# EAGLE design MainBoardV2 (EAGLE 7.2.0)
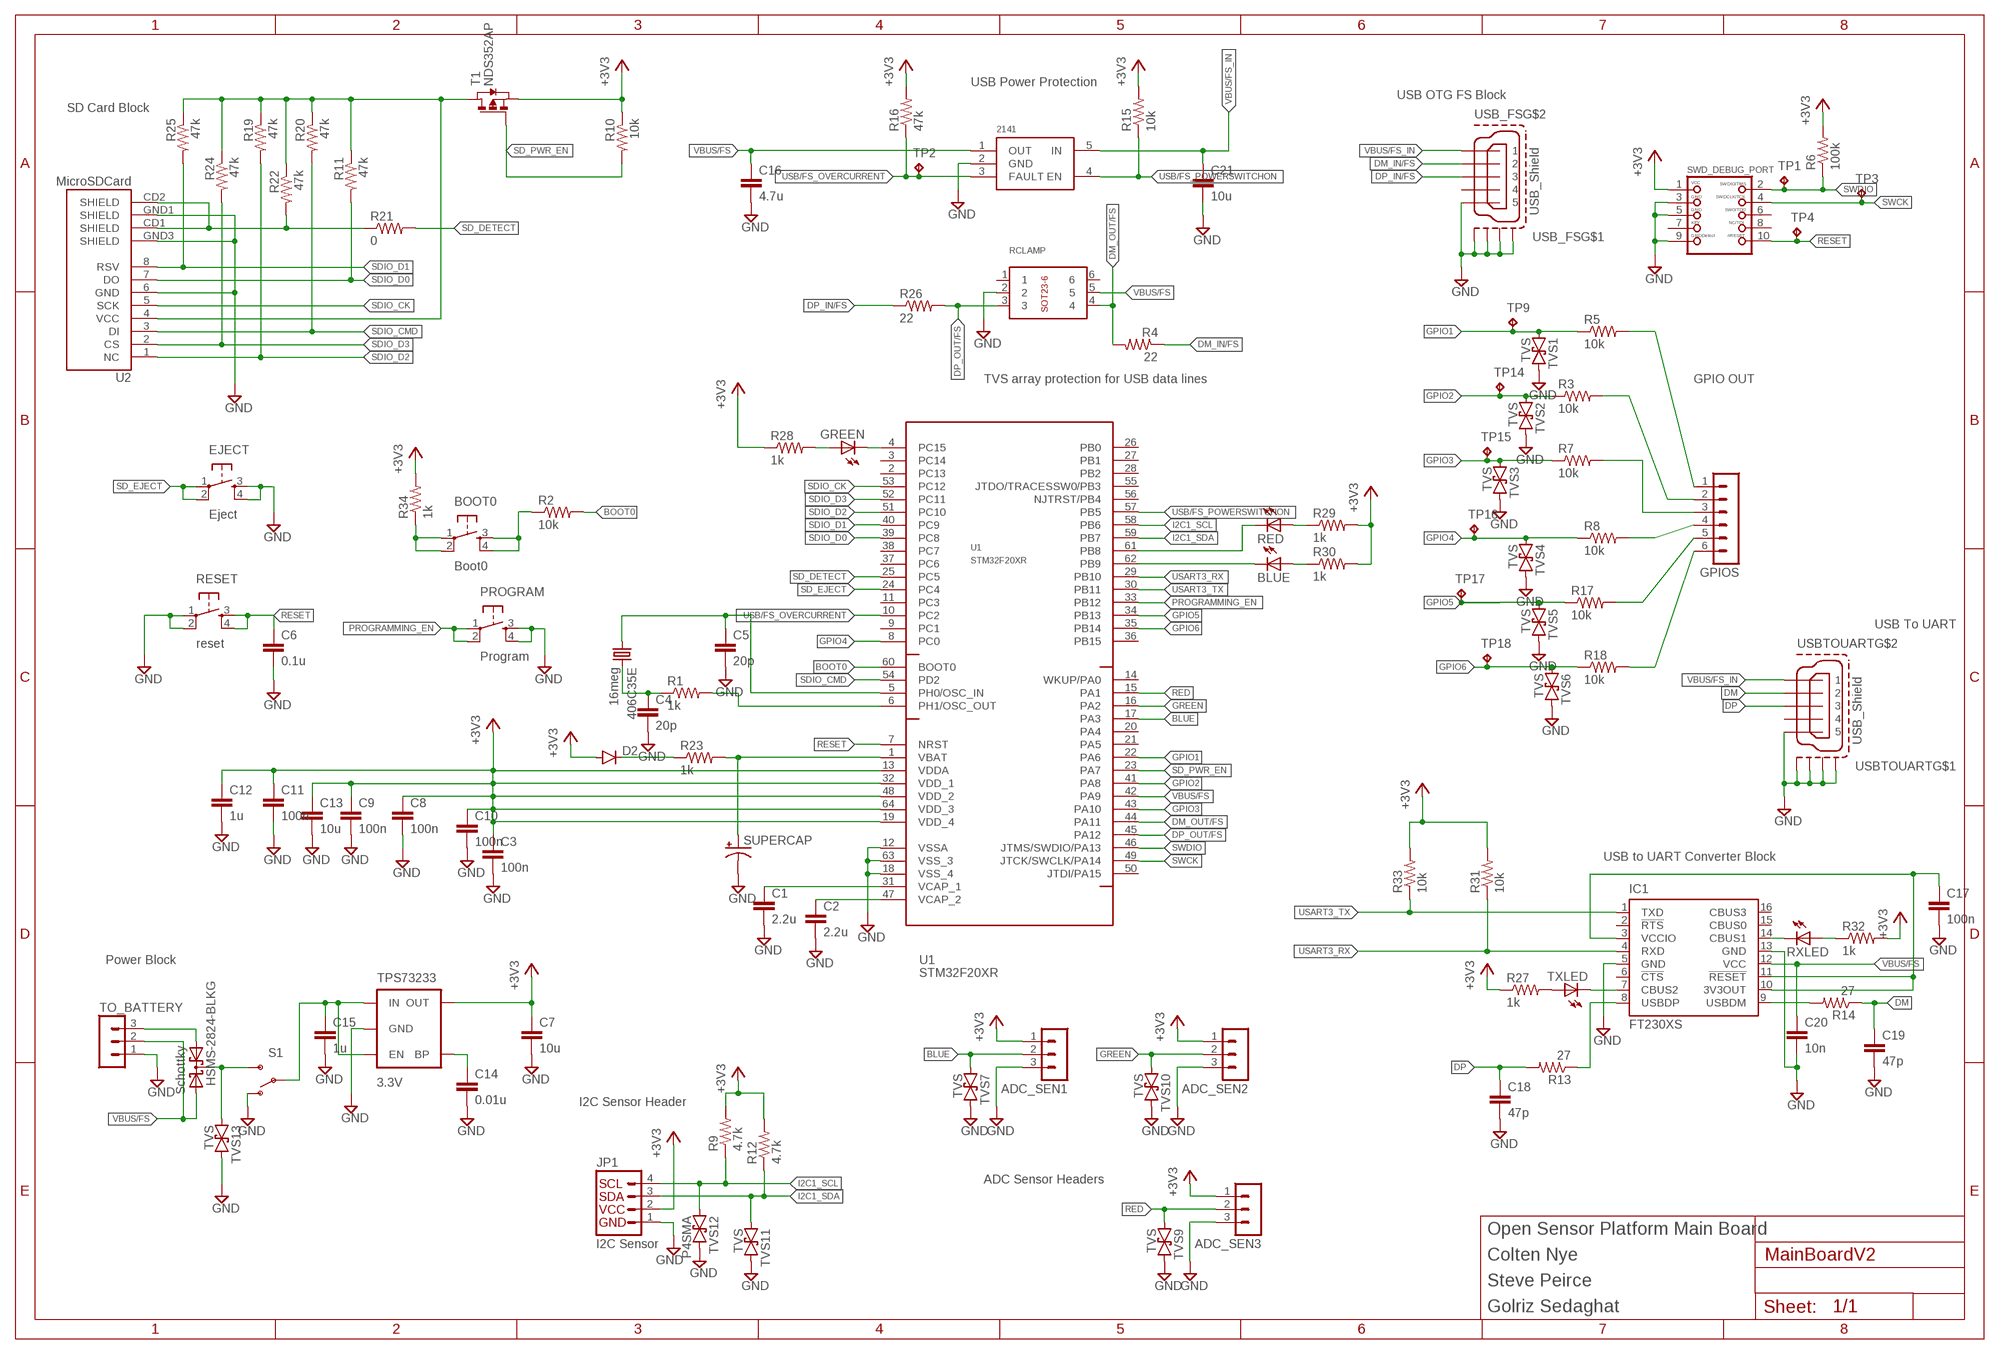
[diagram p0: schematic, sheet 1]

## Parts
406C35E  16meg  CRYSTALCTS406  [CTS406]
2141  NCP1400A_STEPUP  [SOT23-5]
ADC_SEN1  MA03-1  [MA03-1]
ADC_SEN2  MA03-1  [MA03-1]
ADC_SEN3  MA03-1  [MA03-1]
BLUE  LEDSML0805  [SML0805]
BOOT0  Boot0  TAC_SWITCHSMD  [TACTILE-SWITCH-SMD]
C1  2.2u  C-EUC0805  [C0805]
C2  2.2u  C-EUC0805  [C0805]
C3  100n  C-EUC0805  [C0805]
C4  20p  C-EUC0805  [C0805]
C5  20p  C-EUC0805  [C0805]
C6  0.1u  C-EUC0805  [C0805]
C7  10u  C-EUC0805  [C0805]
C8  100n  C-EUC0805  [C0805]
C9  100n  C-EUC0805  [C0805]
C10  100n  C-EUC0805  [C0805]
C11  100n  C-EUC0805  [C0805]
C12  1u  C-EUC0805  [C0805]
C13  10u  C-EUC0805  [C0805]
C14  0.01u  C-EUC0805  [C0805]
C15  1u  C-EUC0805  [C0805]
C16  4.7u  C-EUC0805  [C0805]
C17  100n  C-EUC0805  [C0805]
C18  47p  C-EUC0805  [C0805]
C19  47p  C-EUC0805  [C0805]
C20  10n  C-EUC0805  [C0805]
C21  10u  C-EUC0805  [C0805]
D2  DIODESMA  [SMA-DIODE]
EJECT  Eject  TAC_SWITCHSMD  [TACTILE-SWITCH-SMD]
GPIOS  MA06-1  [MA06-1]
GREEN  LEDSML0805  [SML0805]
HSMS-2824-BLKG  Schottky  BAS70-05  [SOT23]
IC1  FT230XS  [SSOP16]
JP1  I2C Sensor  I2C_STANDARD  [1X04]
PROGRAM  Program  TAC_SWITCHSMD  [TACTILE-SWITCH-SMD]
R1  1k  R-US_R0805  [R0805]
R2  10k  R-US_R0805  [R0805]
R3  10k  R-US_R0805  [R0805]
R4  22  R-US_R0805  [R0805]
R5  10k  R-US_R0805  [R0805]
R6  100k  R-US_R0805  [R0805]
R7  10k  R-US_R0805  [R0805]
R8  10k  R-US_R0805  [R0805]
R9  4.7k  R-US_R0805  [R0805]
R10  10k  R-US_R0805  [R0805]
R11  47k  R-US_R0805  [R0805]
R12  4.7k  R-US_R0805  [R0805]
R13  27  R-US_R0805  [R0805]
R14  27  R-US_R0805  [R0805]
R15  10k  R-US_R0805  [R0805]
R16  47k  R-US_R0805  [R0805]
R17  10k  R-US_R0805  [R0805]
R18  10k  R-US_R0805  [R0805]
R19  47k  R-US_R0805  [R0805]
R20  47k  R-US_R0805  [R0805]
R21  0  R-US_R0805  [R0805]
R22  47k  R-US_R0805  [R0805]
R23  1k  R-US_R0805  [R0805]
R24  47k  R-US_R0805  [R0805]
R25  47k  R-US_R0805  [R0805]
R26  22  R-US_R0805  [R0805]
R27  1k  R-US_R0805  [R0805]
R28  1k  R-US_R0805  [R0805]
R29  1k  R-US_R0805  [R0805]
R30  1k  R-US_R0805  [R0805]
R31  10k  R-US_R0805  [R0805]
R32  1k  R-US_R0805  [R0805]
R33  10k  R-US_R0805  [R0805]
R34  1k  R-US_R0805  [R0805]
RCLAMP  BREAKOUT_SOT23-6  [BREAKOUT_SOT23-6]
RED  LEDSML0805  [SML0805]
RESET  reset  TAC_SWITCHSMD  [TACTILE-SWITCH-SMD]
RXLED  LEDSML0805  [SML0805]
S1  SWITCH-SPDTSMD  [AYZ0202]
SUPERCAP  SUPERCAP  [414-VA5R]
SWD_DEBUG_PORT  JTAG-CORTEXM3  [2X05_1.27MM_SMT]
T1  NDS352AP  PMOSSOT23  [SOT-23]
TO_BATTERY  MA03-1  [MA03-1]
TP1  TPB1,27  [B1,27]
TP2  TPB1,27  [B1,27]
TP3  TPB1,27  [B1,27]
TP4  TPB1,27  [B1,27]
TP9  TPB1,27  [B1,27]
TP14  TPB1,27  [B1,27]
TP15  TPB1,27  [B1,27]
TP16  TPB1,27  [B1,27]
TP17  TPB1,27  [B1,27]
TP18  TPB1,27  [B1,27]
TPS73233  3.3V  V_REG_MIC52053.3V  [SOT23-5]
TVS1  TVS  [SMA-DIODE]
TVS2  TVS  [SMA-DIODE]
TVS3  TVS  [SMA-DIODE]
TVS4  TVS  [SMA-DIODE]
TVS5  TVS  [SMA-DIODE]
TVS6  TVS  [SMA-DIODE]
TVS7  TVS  [SMA-DIODE]
TVS9  TVS  [SMA-DIODE]
TVS10  TVS  [SMA-DIODE]
TVS11  TVS  [SMA-DIODE]
TVS12  P4SMA  TVS  [SMA-DIODE]
TVS13  TVS  [SMA-DIODE]
TXLED  LEDSML0805  [SML0805]
U1  STM32F20XR  [LQFP64]
U2  MicroSDCard  USD-SOCKETNEW  [MICRO-SD-SOCKET-PP]
USB_FS  USB_Shield  MICRO-USB-SHIELD-ZX62R-B-5P  [ZX62R-B-5P]
USBTOUART  USB_Shield  MICRO-USB-SHIELD-ZX62R-B-5P  [ZX62R-B-5P]

## Nets
+3V3: ADC_SEN1.1 ADC_SEN2.1 ADC_SEN3.1 C3.1 C7.1 C8.1 C9.1 C10.1 C11.1 C12.1 C13.1 D2.A JP1.2 R6.2 R9.2 R10.1 R12.2 R15.2 R16.2 R27.1 R28.1 R29.2 R30.2 R31.2 R32.2 R33.2 R34.2 SWD_DEBUG_PORT.1 T1.2(S) TPS73233.5(OUT) U1.13(VDDA) U1.19(VDD_4) U1.32(VDD_1) U1.48(VDD_2) U1.64(VDD_3)
BLUE: ADC_SEN1.2 TVS7.A U1.17(PA3)
BOOT0: R2.2 U1.60(BOOT0)
DEBUG_LED/NP1: GPIOS.1 R5.2
DEBUG_LED/NP2: GPIOS.2 R3.2
DEBUG_LED/NP3: GPIOS.3 R7.2
DEBUG_LED/NP4: GPIOS.4 R8.2
DEBUG_LED/NP5: GPIOS.5 R17.2
DEBUG_LED/NP6: GPIOS.6 R18.2
DM: C19.1 R14.1 USBTOUART.2
DM_IN/FS: R4.1 USB_FS.2
DM_OUT/FS: R4.2 RCLAMP.4 U1.44(PA11)
DP: C18.1 R13.2 USBTOUART.3
DP_IN/FS: R26.1 USB_FS.3
DP_OUT/FS: R26.2 RCLAMP.3 U1.45(PA12)
GND: 2141.2(GND) ADC_SEN1.3 ADC_SEN2.3 ADC_SEN3.3 C1.2 C2.2 C3.2 C4.2 C5.2 C6.2 C7.2 C8.2 C9.2 C10.2 C11.2 C12.2 C13.2 C14.2 C15.2 C16.2 C17.2 C18.2 C19.2 C20.2 C21.2 EJECT.3 EJECT.4 IC1.5(GND) IC1.13(GND) JP1.1 PROGRAM.3 PROGRAM.4 RCLAMP.2 RESET.1 RESET.2 S1.1(O) SUPERCAP.- SWD_DEBUG_PORT.3 SWD_DEBUG_PORT.5 SWD_DEBUG_PORT.9 TO_BATTERY.1 TPS73233.2(GND) TVS1.C TVS2.C TVS3.C TVS4.C TVS5.C TVS6.C TVS7.C TVS9.C TVS10.C TVS11.C TVS12.C TVS13.C U1.12(VSSA) U1.18(VSS_4) U1.63(VSS_3) U2.6(GND) U2.GND1(SHIELD) U2.GND3(SHIELD) USB_FS.5 USB_FS.M1(S1) USB_FS.M2(S2) USB_FS.M3(S3) USB_FS.M4(S4) USBTOUART.5 USBTOUART.M1(S1) USBTOUART.M2(S2) USBTOUART.M3(S3) USBTOUART.M4(S4)
GPIO1: R5.1 TP9.TP TVS1.A U1.22(PA6)
GPIO2: R3.1 TP14.TP TVS2.A U1.41(PA8)
GPIO3: R7.1 TP15.TP TVS3.A U1.43(PA10)
GPIO4: R8.1 TP16.TP TVS4.A U1.8(PC0)
GPIO5: R17.1 TP17.TP TVS5.A U1.34(PB13)
GPIO6: R18.1 TP18.TP TVS6.A U1.35(PB14)
GREEN: ADC_SEN2.2 TVS10.A U1.16(PA2)
I2C1_SCL: JP1.4 R9.1 TVS12.A U1.58(PB6)
I2C1_SDA: JP1.3 R12.1 TVS11.A U1.59(PB7)
N$1: C1.1 U1.31(VCAP_1)
N$2: C2.1 U1.47(VCAP_2)
N$3: GREEN.C U1.4(PC15)
N$4: HSMS-2824-BLKG.1(A1) TO_BATTERY.3
N$5: 406C35E.3 C4.1 R1.1
N$6: BOOT0.3 BOOT0.4 R2.1
N$7: C17.1 IC1.3(VCCIO) IC1.10(3V3OUT) IC1.11(!RESET)
N$8: IC1.9(USBDM) R14.2
N$9: IC1.8(USBDP) R13.1
N$10: C14.1 TPS73233.4(BP)
N$11: BOOT0.1 BOOT0.2 R34.1
N$12: R27.2 TXLED.A
N$13: BLUE.C U1.62(PB9)
N$14: R21.1 R22.2 U2.CD1(SHIELD) U2.CD2(SHIELD)
N$15: D2.C R23.1
N$16: R29.1 RED.A
N$17: GREEN.A R28.2
N$18: BLUE.A R30.1
N$19: R32.1 RXLED.A
N$20: RED.C U1.61(PB8)
N$21: HSMS-2824-BLKG.3(C) S1.3(S) TVS13.A
N$22: IC1.14(CBUS1) RXLED.C
N$23: IC1.7(CBUS2) TXLED.C
N$26: R11.1 R19.1 R20.1 R22.1 R24.1 R25.1 T1.1(D) U2.4(VCC)
OSC_IN: 406C35E.1 C5.1 U1.5(PH0/OSC_IN)
OSC_OUT: R1.2 U1.6(PH1/OSC_OUT)
PROGRAMMING_EN: PROGRAM.1 PROGRAM.2 U1.33(PB12)
RED: ADC_SEN3.2 TVS9.A U1.15(PA1)
RESET: C6.1 RESET.3 RESET.4 SWD_DEBUG_PORT.10 TP4.TP U1.7(NRST)
SD_DETECT: R21.2 U1.25(PC5)
SD_EJECT: EJECT.1 EJECT.2 U1.24(PC4)
SD_PWR_EN: R10.2 T1.3(G) U1.23(PA7)
SDIO_CK: U1.53(PC12) U2.5(SCK)
SDIO_CMD: R20.2 U1.54(PD2) U2.3(DI)
SDIO_D0: R11.2 U1.39(PC8) U2.7(DO)
SDIO_D1: R25.2 U1.40(PC9) U2.8(RSV)
SDIO_D2: R19.2 U1.51(PC10) U2.1(NC)
SDIO_D3: R24.2 U1.52(PC11) U2.2(CS)
SWCK: SWD_DEBUG_PORT.4 TP3.TP U1.49(JTCK/SWCLK/PA14)
SWDIO: R6.1 SWD_DEBUG_PORT.2 TP1.TP U1.46(JTMS/SWDIO/PA13)
USART3_RX: IC1.4(RXD) R31.1 U1.29(PB10)
USART3_TX: IC1.1(TXD) R33.1 U1.30(PB11)
USB/FS_OVERCURRENT: 2141.3(FAULT) R16.1 TP2.TP U1.10(PC2)
USB/FS_POWERSWITCHON: 2141.4(EN) R15.1 U1.57(PB5)
VBAT: R23.2 SUPERCAP.+ U1.1(VBAT)
VBUS/FS: 2141.1(OUT) C16.1 C20.1 HSMS-2824-BLKG.2(A2) IC1.12(VCC) RCLAMP.5 TO_BATTERY.2 U1.42(PA9)
VBUS/FS_IN: 2141.5(IN) C21.1 USB_FS.1 USBTOUART.1
VIN: C15.1 S1.2(P) TPS73233.1(IN) TPS73233.3(EN)
Unconnected: IC1.2(!RTS) IC1.6(!CTS) IC1.15(CBUS0) IC1.16(CBUS3) RCLAMP.1 RCLAMP.6 SWD_DEBUG_PORT.6 SWD_DEBUG_PORT.7 SWD_DEBUG_PORT.8 U1.2(PC13) U1.3(PC14) U1.9(PC1) U1.11(PC3) U1.14(WKUP/PA0) U1.20(PA4) U1.21(PA5) U1.26(PB0) U1.27(PB1) U1.28(PB2) U1.36(PB15) U1.37(PC6) U1.38(PC7) U1.50(JTDI/PA15) U1.55(JTDO/TRACESSW0/PB3) U1.56(NJTRST/PB4) USB_FS.4 USBTOUART.4

## Notes on the sheet
- USB Power Protection
- USB OTG FS Block
- SD Card Block
- TVS array protection for USB data lines | GPIO OUT
- USB To UART
- USB to UART Converter Block
- Power Block
- I2C Sensor Header
- ADC Sensor Headers
- Open Sensor Platform Main Board
- Colten Nye
- Steve Peirce
- Golriz Sedaghat

## Library data of the parts
406C35E = crystal:CRYSTAL: CRYSTAL; OC_FARNELL: unknown; OC_NEWARK: unknown
2141 = microbuilder:NCP1400A_STEPUP: NCP1400A - 100mA PWM Step-Up Regulator 100mA step-up DC-to-DC converter with low 0.8V startup. 3.3V Version (SOT23-5) - Digikey: NCP1400ASN33T1GOSCT-ND 5.0V Version (SOT23-5) - Digikey: NCP1400ASN50T1GOSCT-ND NCP1402 - 200mA PWM Step-Up Regulator 200mA step-up DC-to-DC converter with low 0.8V startup 3.3V Version (SOT23-5) - Digikey: NCP1402SN33T1GOSCT-ND 5.0V Version (SOT23-5) - Digikey: NCP1402SN50T1GOSCT-ND
ADC_SEN1-ADC_SEN3 TO_BATTERY = con-lstb:MA03-1: PIN HEADER; OC_FARNELL: unknown; OC_NEWARK: unknown
BLUE GREEN RED RXLED TXLED = led:LED: LED OSRAM: - CHIPLED LG R971, LG N971, LY N971, LG Q971, LY Q971, LO R971, LY R971 LH N974, LH R974 LS Q976, LO Q976, LY Q976 LO Q996 - Hyper CHIPLED LW Q18S LB Q993, LB Q99A, LB R99A - SideLED LS A670, LO A670, LY A670, LG A670, LP A670 LB A673, LV A673, LT A673, LW A673 LH A674 LY A675 LS A676, LA A676, LO A676, LY A676, LW A676 LS A679, LY A679, LG A679 - Hyper Micro SIDELED® LS Y876, LA Y876, LO Y876, LY Y876 LT Y87S - SmartLED LW L88C, LW L88S LB L89C, LB L89S, LG L890 LS L89K, LO L89K, LY L89K LS L896, LA L896, LO L896, LY L896 - TOPLED LS T670, LO T670, LY T670, LG T670, LP T670 LSG T670, LSP T670, LSY T670, LOP T670, LYG T670 LG T671, LOG T671, LSG T671 LB T673, LV T673, LT T673, LW T673 LH T674 LS T676, LA T676, LO T676, LY T676, LB T676, LH T676, LSB T676, LW T676 LB T67C, LV T67C, LT T67C, LS T67K, LO T67K, LY T67K, LW E67C LS E67B, LA E67B, LO E67B, LY E67B, LB E67C, LV E67C, LT E67C LW T67C LS T679, LY T679, LG T679 LS T770, LO T770, LY T770, LG T770, LP T770 LB T773, LV T773, LT T773, LW T773 LH T774 LS E675, LA E675, LY E675, LS T675 LS T776, LA T776, LO T776, LY T776, LB T776 LHGB T686 LT T68C, LB T68C - Hyper Mini TOPLED® LB M676 - Mini TOPLED Santana® LG M470 LS M47K, LO M47K, LY M47K Source: http://www.osram.convergy.de LUXEON: - LUMILED® LXK2-PW12-R00, LXK2-PW12-S00, LXK2-PW14-U00, LXK2-PW14-V00 LXK2-PM12-R00, LXK2-PM12-S00, LXK2-PM14-U00 LXK2-PE12-Q00, LXK2-PE12-R00, LXK2-PE12-S00, LXK2-PE14-T00, LXK2-PE14-U00 LXK2-PB12-K00, LXK2-PB12-L00, LXK2-PB12-M00, LXK2-PB14-N00, LXK2-PB14-P00, LXK2-PB14-Q00 LXK2-PR12-L00, LXK2-PR12-M00, LXK2-PR14-Q00, LXK2-PR14-R00 LXK2-PD12-Q00, LXK2-PD12-R00, LXK2-PD12-S00 LXK2-PH12-R00, LXK2-PH12-S00 LXK2-PL12-P00, LXK2-PL12-Q00, LXK2-PL12-R00 Source: www.luxeon.com KINGBRIGHT: KA-3528ASYC Source: www.kingbright.com
BOOT0 EJECT PROGRAM RESET = SparkFun-Electromechanical:TAC_SWITCH: Momentary Switch Button commonly used for reset or general input. Spark Fun Electronics SKU : COM-00097 SMT- SWCH-08247; PROD_ID: SWCH-08247; VALUE: TAC_SWITCHSMD
C1-C21 = rcl:C-EU: CAPACITOR, European symbol
D2 = SparkFun-DiscreteSemi:DIODE: Diode These are standard reverse protection diodes and small signal diodes. SMA package can handle up to about 1A. SOD-323 can handle about 200mA. What the SOD-323 package when ordering, there are some mfgs out there that are 5-pin packages.
GPIOS = con-lstb:MA06-1: PIN HEADER; OC_FARNELL: unknown; OC_NEWARK: unknown
HSMS-2824-BLKG = diode:BAS70-05: Silicon Schottky Diodes General-purpose diode for high-speed switching
IC1 = ftdichip:FT230X: USB to BASIC UART IC Auto generated by make-symbol-device-package-bsdl.ulp Rev. 43 Source: Data sheet <http://www.ftdichip.com/Support/Documents/DataSheets/ICs/DS_FT230X.pdf>
JP1 = SparkFun-Connectors:I2C_STANDARD: SparkFun has standardized on a pinout for all I2C based sensor breakouts. This pinout allows I2C boards to be plugged directly into the headers on Arduino Uno compatible boards, and to be daisy chained easily.
R1-R34 = rcl:R-US_: RESISTOR, American symbol
RCLAMP = microbuilder:BREAKOUT_SOT23-6: IC Breakout SOT23-6
S1 = SparkFun-Electromechanical:SWITCH-SPDT: SPDT Switch Simple slide switch, Spark Fun Electronics SKU : COM-00102 DPDT SMT slide switch, AYZ0202, SWCH-08179; PROD_ID: SWCH-08179
SUPERCAP = adafruit:SUPERCAP
SWD_DEBUG_PORT = microbuilder:JTAG-CORTEXM3: Serial Wire (SW-DP) Connector This standard 0.05" 10-pin connector is for use with the Cortex M0/M3's native SWD (serial wire debugger) interface (SW-DP). Some boards support a 20-pin combined JTAG+SWD connector (SWJ-DP), such as the LPC1700 family, but many smaller devices only work with SWD which typically use the smaller 10-pin SW-DP connecter (the LPC1300 family, for example, only supports SWD). 2x05 1.27mm/0.05" Connector: This is the standard SMT connector defined by ARM for all Cortex devices, and should be used in most situations and for forward-compatibility since any new devices coming to market will likely use this connector. MOLEX 10 Pin 0.1" Connector: This 0.1" 10 pin connector has the same pin layout as the standard 0.05" connector, but is easier to work with if you are using standard jumper wires or custom cables to connect your SWD hardware. MOLEX 20 Pin 0.1" Connector: This 0.1" 20 pin connector is the same model used for ARM7/ARM9 JTAG debuggers, but is connected to match the pins on the Segger J-Link for ARM (which supports both JTAG and SWD debugging). See the following document from ARM for more information on Cortex M3 Debug Connectors: http://infocenter.arm.com/help/topic/com.arm.doc.faqs/attached/13634/cortex_debug_connectors.pdf And the following page for an overview with images of the different connector types: http://www.keil.com/peripherals/coresight/connectors.asp
T1 = zetex:PMOSSOT23: MOS FET; OC_FARNELL: unknown; OC_NEWARK: unknown
TP1-TP4 TP9 TP14-TP18 = testpad:TP: Test pad
TPS73233 = SparkFun-PowerIC:V_REG_MIC5205: V_REG MIC5219 Standard 3.3V and 5V 150mA LDO voltage regulator in SOT-23 layout. Micrel part MIC5205. BP (by-pass) pin is used to lower output noise with 470pF cap, may be left open.; PROD_ID: VREG-00822; VALUE: 3.3V/150mA
TVS1-TVS7 TVS9-TVS13 = SparkFun-DiscreteSemi:TVS: Transient voltage suppressor- prevents ESD on inputs. Ignore package description- MBRA140 is NOT this type of part!!!
U1 = stm32F:STM32F20XR
U2 = SparkFun-Connectors:USD-SOCKET: microSD Socket Push-push type uSD socket. Schematic element and footprint production proven. Spark Fun Electronics SKU : PRT-00127. tDoc lines correctly indicate media card edge positions when inserting (unlocked, locked, depressed).
USB_FS USBTOUART = con-hirose:MICRO-USB-SHIELD-: Hirose Micro USB Connector ZX62R-B-5P: Micro B, reverse (top mount) shell SMT Supplier: DigiKey H11574CT-ND Source: http://www.hirose.co.jp/cataloge_hp/e24200011.pdf

## Board
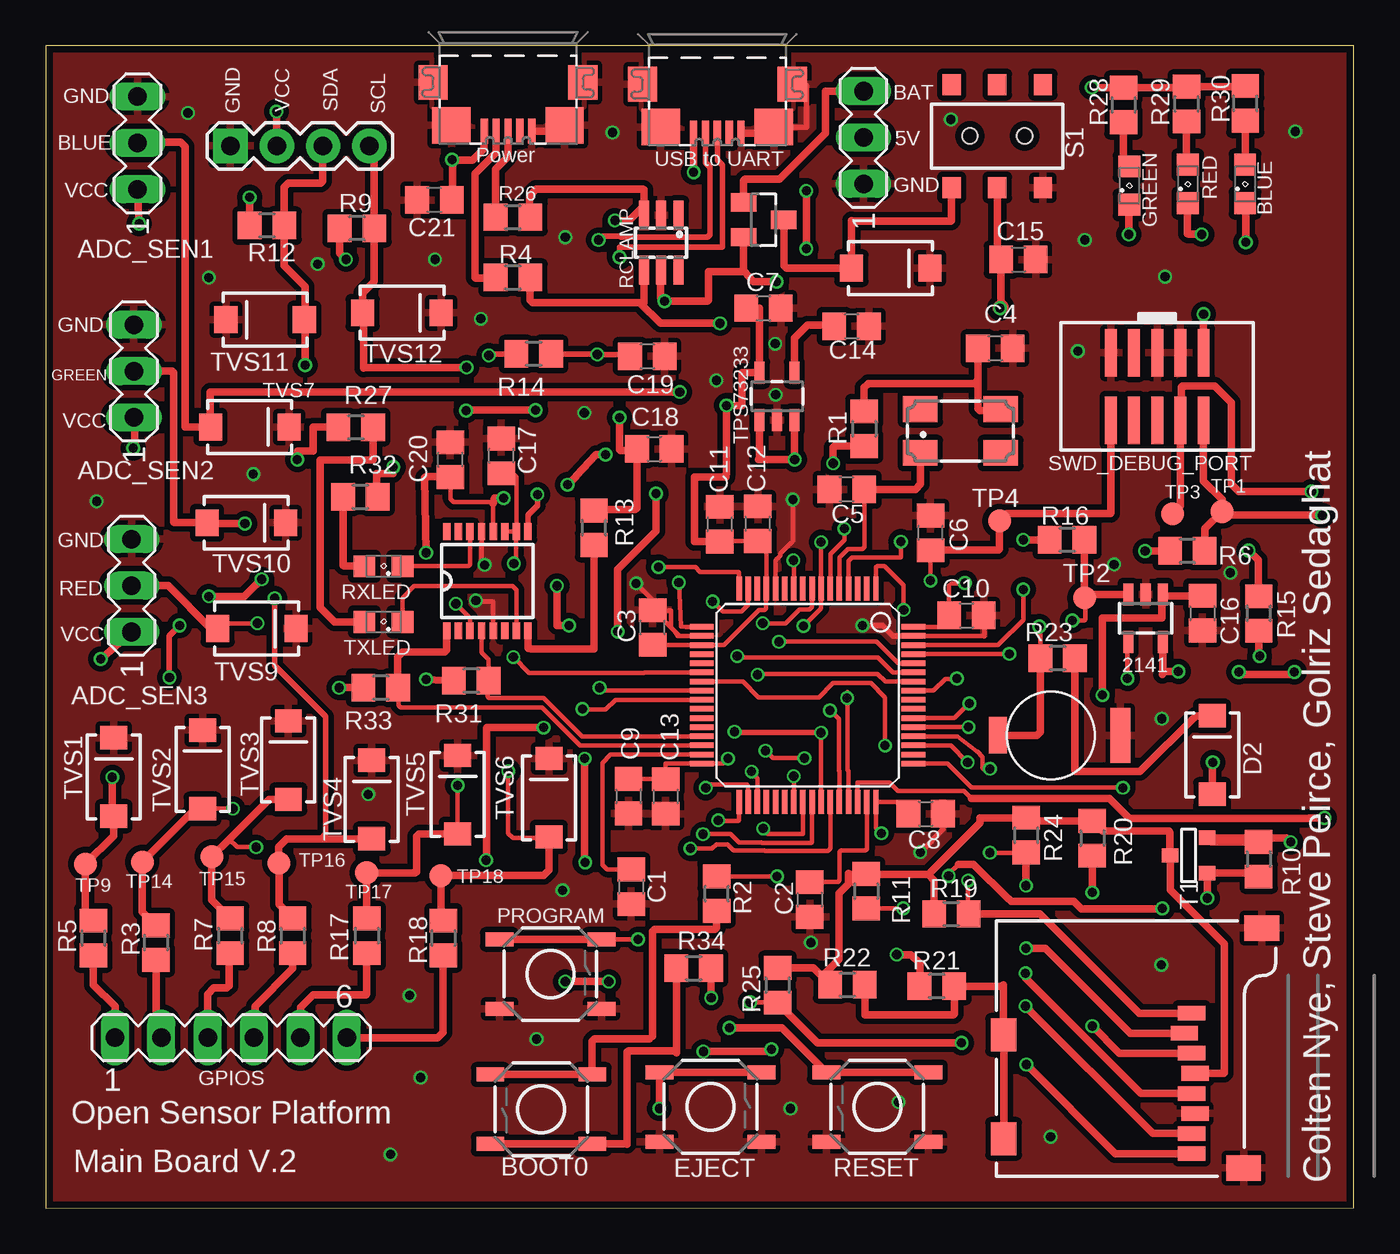
[diagram p1: board, top side]
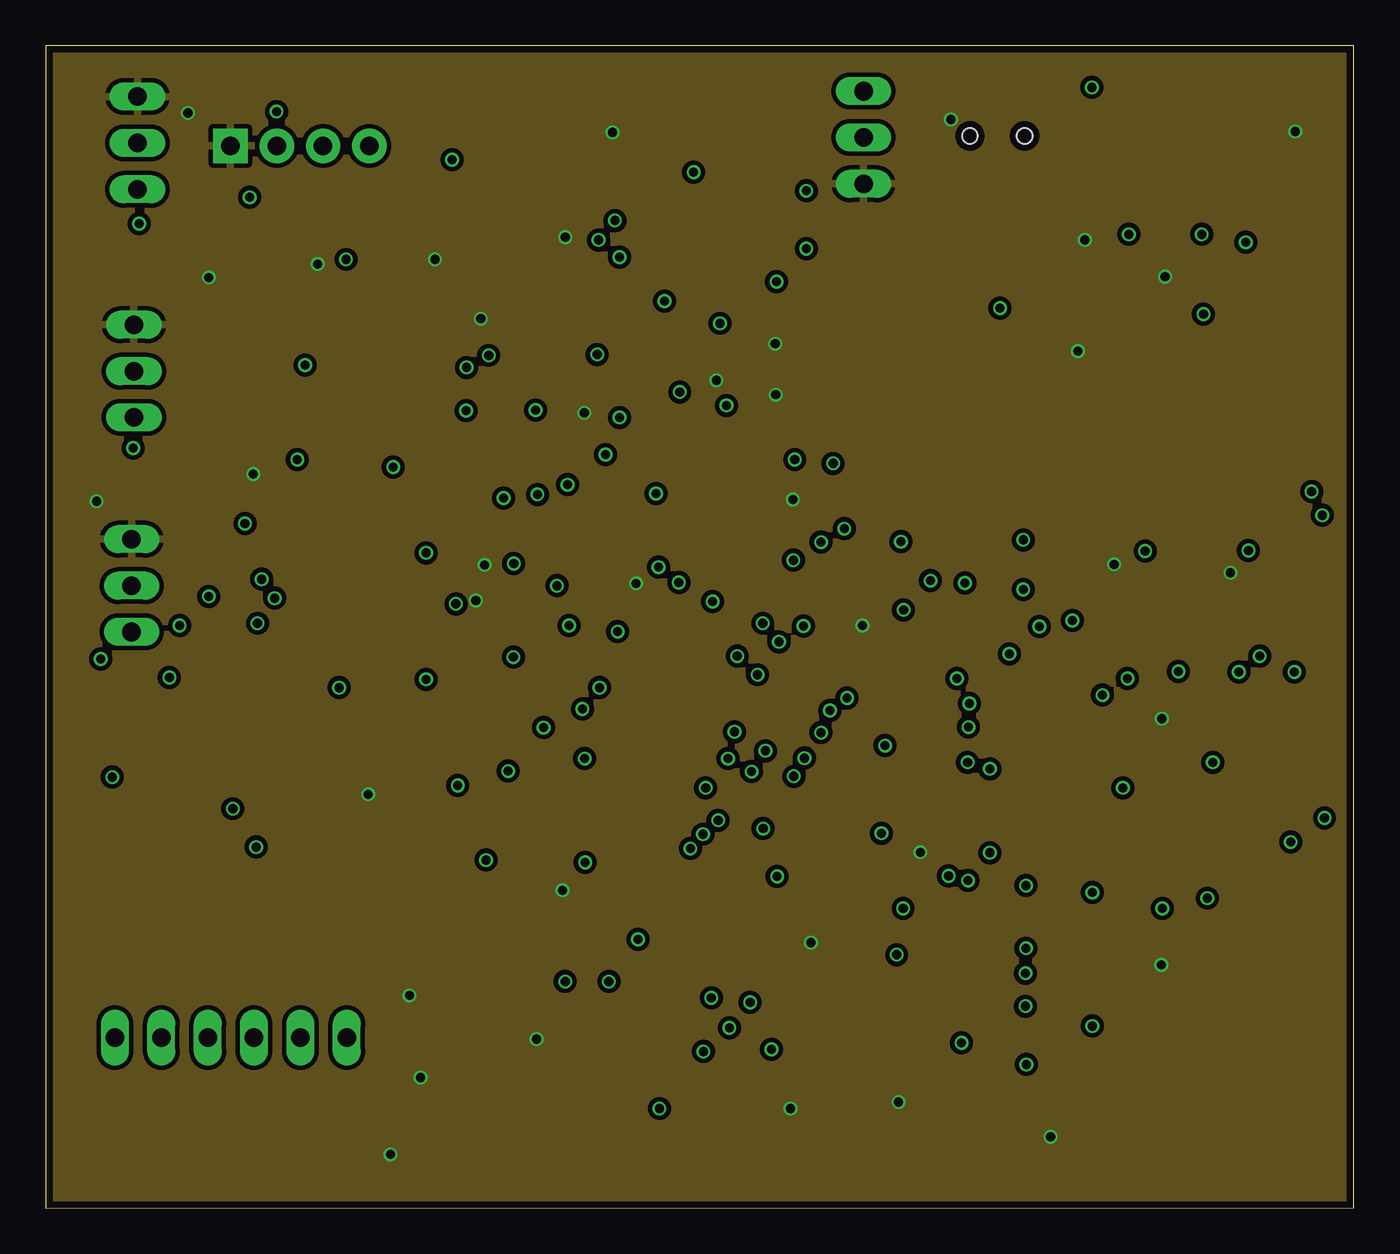
[diagram p2: board, inner layer GND]
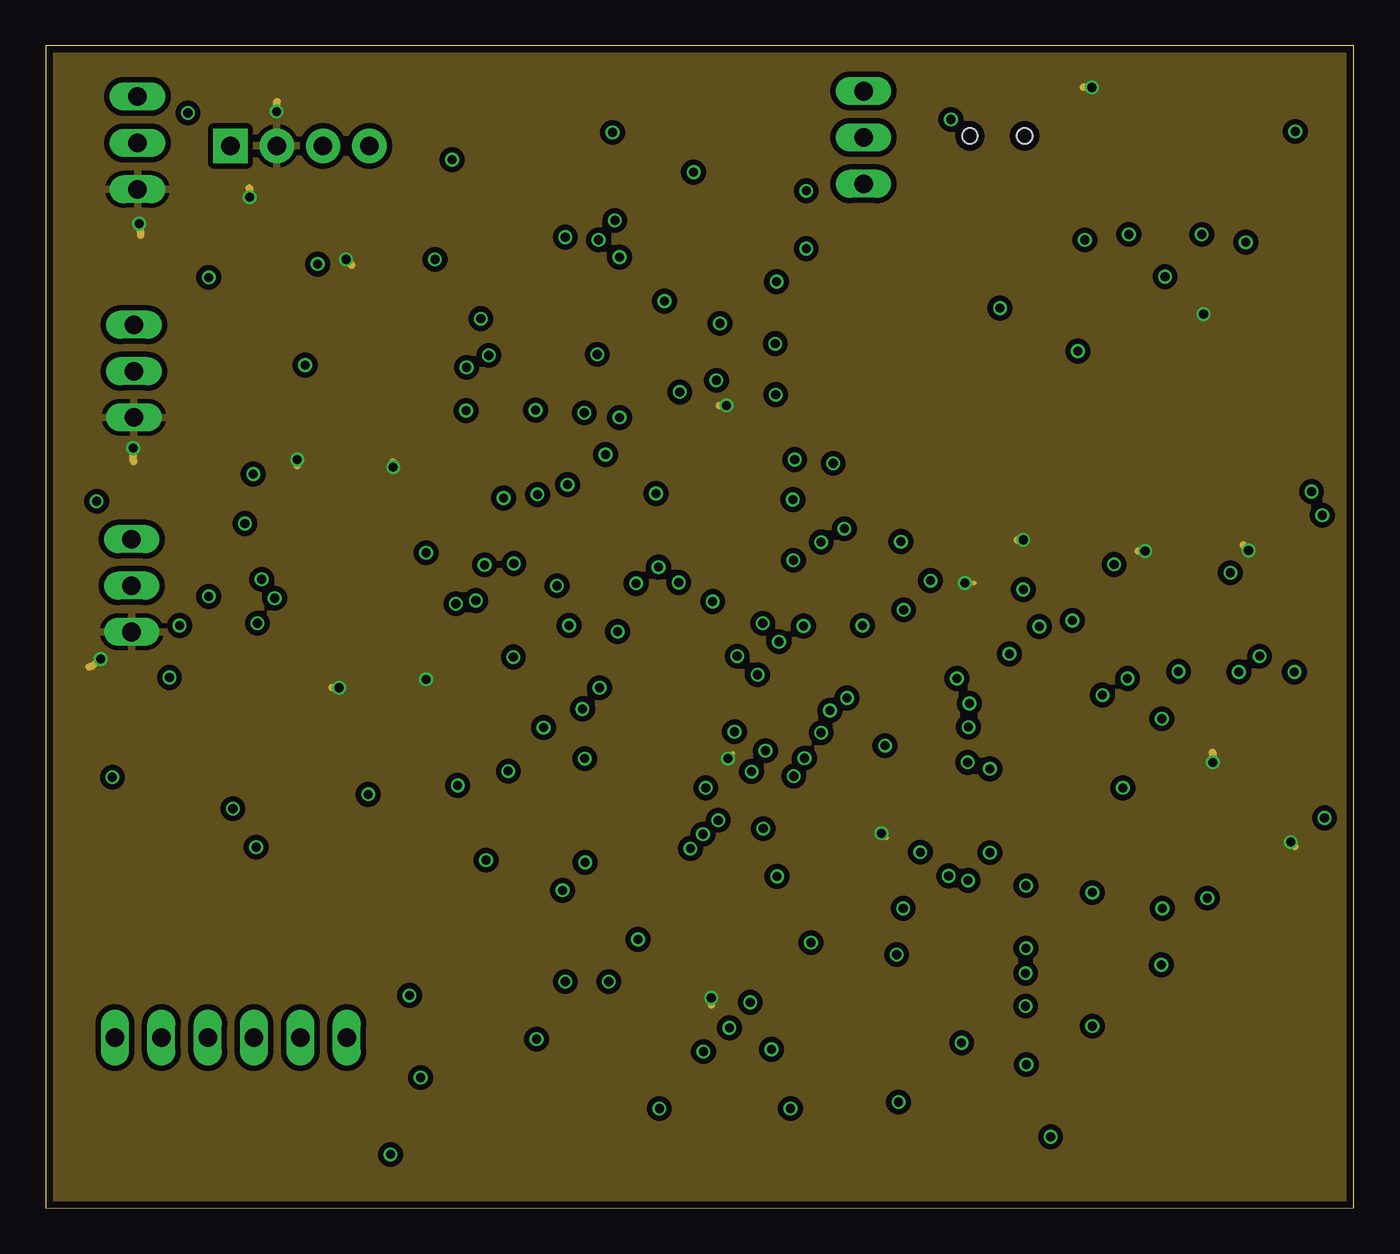
[diagram p3: board, inner layer +3V3]
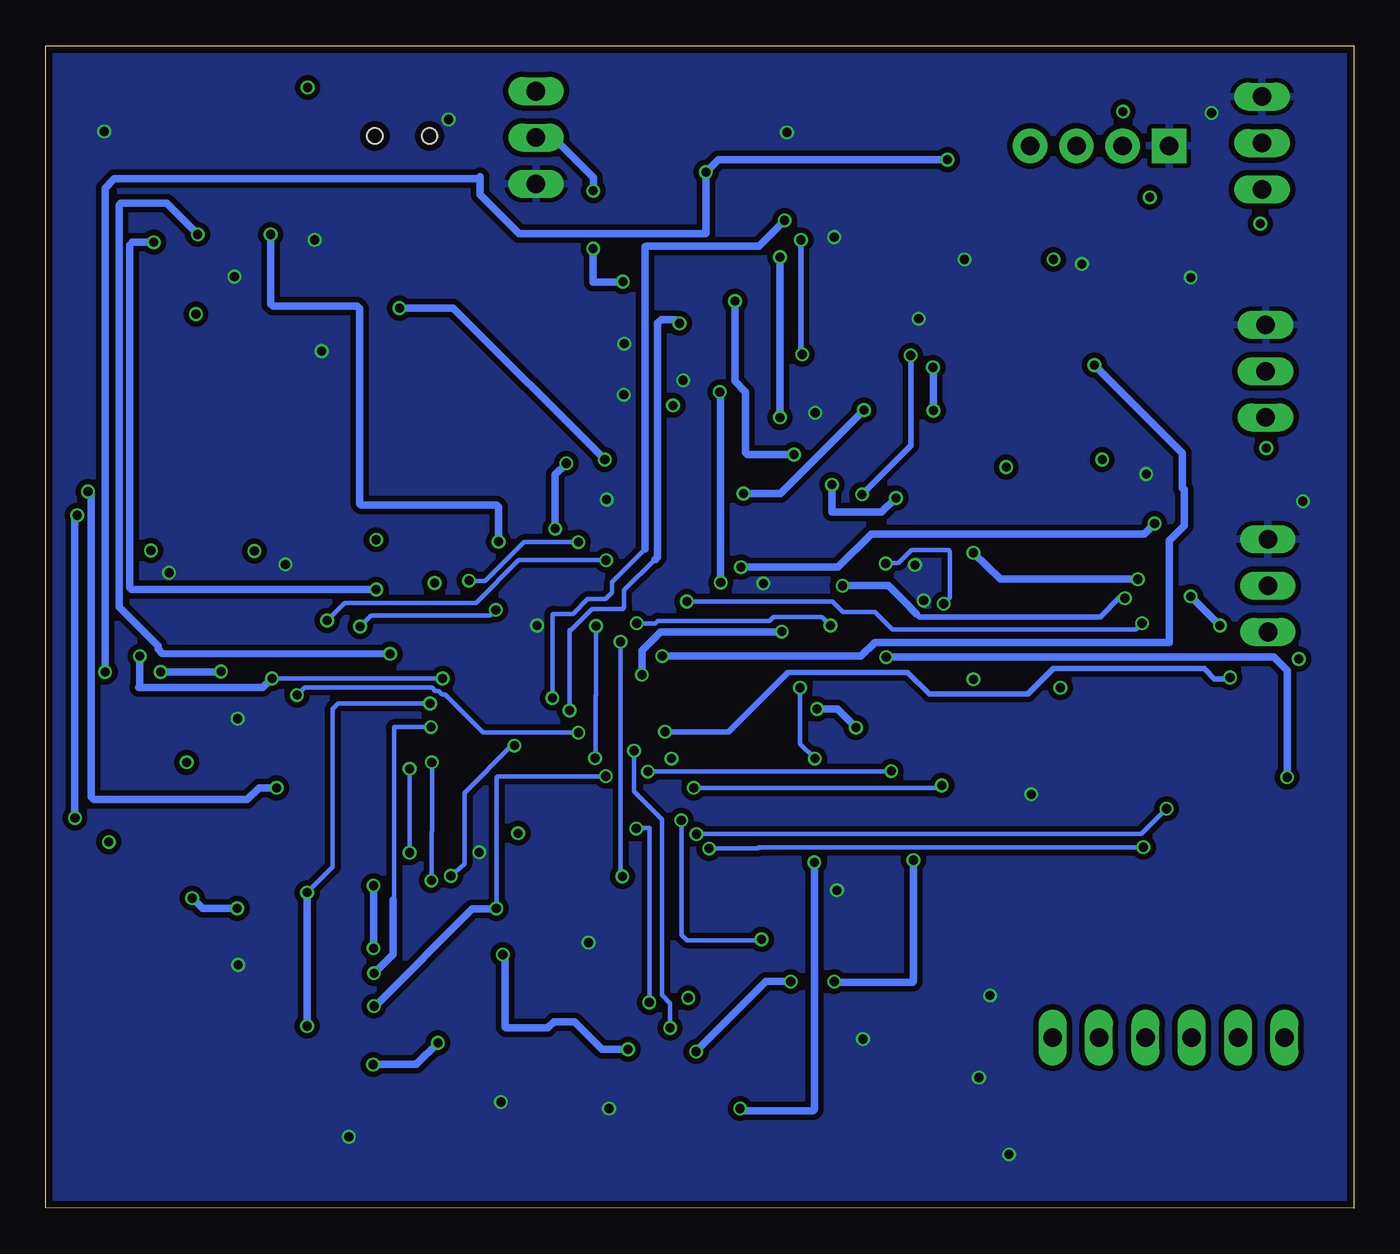
[diagram p4: board, bottom side, seen from below]

Size 71.69 x 63.7 mm. Coordinates in mm from the lower left corner, seen from the top.
Outline: 0,0 71.68,0.01 71.69,63.7 0.01,63.69 0,0
Copper layers (1*2*15*16): Top 0.035559375mm / dielectric 0.17018125mm / GND 0.01778125mm / dielectric 47mil / +3V3 0.01778125mm / dielectric 0.17018125mm / Bottom 0.035559375mm
Design rules "OSHPark-4layer": minimum track width 5mil, minimum drill 10mil, track to track 5mil, track to pad 5mil, pad to pad 5mil, via to via 5mil, smd to smd 5mil, copper to edge 15mil, drill to drill 6mil, minimum pad ring 4mil, minimum via ring 4mil, stop-mask expansion 4mil, vias tented up to drill 0mil, thermal gap 10mil

### Footprints (pad centres in the part's own frame; a part is rotated, then mirrored left to right if it is on the bottom)
CTS406 = smd 1.9 x 1.4: 1 -2.2,-1.2; 2 2.2,-1.2; 3 2.2,1.2; 4 -2.2,1.2
SOT23-5 = smd 0.55 x 1.2: 1 -0.95,-1.3; 2 0,-1.3; 3 0.95,-1.3; 4 0.95,1.3; 5 -0.95,1.3
MA03-1 = drill 1.016 long: 1 -2.54,0; 2 0,0; 3 2.54,0
SML0805 = smd 1.2 x 1.2: A 1.05,0; C -1.05,0
TACTILE-SWITCH-SMD = smd 1.524 x 0.762: 1 -2.794,1.905; 2 2.794,1.905; 3 -2.794,-1.905; 4 2.794,-1.905
C0805 = smd 1.3 x 1.5: 1 -0.95,0; 2 0.95,0
SMA-DIODE = smd 1.27 x 1.47: A -2.15,0; C 2.15,0
MA06-1 = drill 1.016 long: 1 -6.35,0; 2 -3.81,0; 3 -1.27,0; 4 1.27,0; 5 3.81,0; 6 6.35,0
SOT23 = smd 1 x 1.4: 1 -0.95,-1.1; 2 0.95,-1.1; 3 0,1.1
SSOP16 = smd 0.914 x 0.406: 1 -2.718,2.223; 2 -2.718,1.587; 3 -2.718,0.953; 4 -2.718,0.318; 5 -2.718,-0.318; 6 -2.718,-0.953; 7 -2.718,-1.587; 8 -2.718,-2.223; 9 2.718,-2.223; 10 2.718,-1.587; 11 2.718,-0.953; 12 2.718,-0.318; 13 2.718,0.318; 14 2.718,0.953; 15 2.718,1.587; 16 2.718,2.223
1X04 = drill 1.016 pad 1.88 square: 1 0,0 | drill 1.016 pad 1.88: 2 2.54,0; 3 5.08,0; 4 7.62,0
R0805 = smd 1.3 x 1.5: 1 -0.95,0; 2 0.95,0
BREAKOUT_SOT23-6 = smd 0.55 x 1.6: 1 -0.95,-1.5; 2 0,-1.5; 3 0.95,-1.5; 4 0.95,1.5; 5 0,1.5; 6 -0.95,1.5
AYZ0202 = smd 1 x 1.15: 1 -2.5,2.825; 2 0,2.825; 3 2.5,2.825; 4 -2.5,-2.825; 5 0,-2.825; 6 2.5,-2.825 | hole 0.85: 1.5,0; -1.5,0
414-VA5R = smd 1 x 2: + -2.9,0 | smd 1.1 x 3: - 3.8,0
2X05_1.27MM_SMT = smd 0.65 x 2.6: 1 -2.54,-1.85; 2 -2.54,1.85; 3 -1.27,-1.85; 4 -1.27,1.85; 5 0,-1.85; 6 0,1.85; 7 1.27,-1.85; 8 1.27,1.85; 9 2.54,-1.85; 10 2.54,1.85
SOT-23 = smd 0.787 x 0.889: 1 0.025,-1.016; 2 -0.94,1.016; 3 0.991,1.016
B1,27 = smd 1.27 x 1.27: TP 0,0
LQFP64 = smd 1.3 x 0.3: 1 -5.85,3.75; 2 -5.85,3.25; 3 -5.85,2.75; 4 -5.85,2.25; 5 -5.85,1.75; 6 -5.85,1.25; 7 -5.85,0.75; 8 -5.85,0.25; 9 -5.85,-0.25; 10 -5.85,-0.75; 11 -5.85,-1.25; 12 -5.85,-1.75; 13 -5.85,-2.25; 14 -5.85,-2.75; 15 -5.85,-3.25; 16 -5.85,-3.75; 33 5.85,-3.75; 34 5.85,-3.25; 35 5.85,-2.75; 36 5.85,-2.25; 37 5.85,-1.75; 38 5.85,-1.25; 39 5.85,-0.75; 40 5.85,-0.25; 41 5.85,0.25; 42 5.85,0.75; 43 5.85,1.25; 44 5.85,1.75; 45 5.85,2.25; 46 5.85,2.75; 47 5.85,3.25; 48 5.85,3.75 | smd 0.3 x 1.3: 17 -3.75,-5.8; 18 -3.25,-5.8; 19 -2.75,-5.8; 20 -2.25,-5.8; 21 -1.75,-5.8; 22 -1.25,-5.8; 23 -0.75,-5.8; 24 -0.25,-5.8; 25 0.25,-5.8; 26 0.75,-5.8; 27 1.25,-5.8; 28 1.75,-5.8; 29 2.25,-5.8; 30 2.75,-5.8; 31 3.25,-5.8; 32 3.75,-5.8; 49 3.75,5.8; 50 3.25,5.8; 51 2.75,5.8; 52 2.25,5.8; 53 1.75,5.8; 54 1.25,5.8; 55 0.75,5.8; 56 0.25,5.8; 57 -0.25,5.8; 58 -0.75,5.8; 59 -1.25,5.8; 60 -1.75,5.8; 61 -2.25,5.8; 62 -2.75,5.8; 63 -3.25,5.8; 64 -3.75,5.8
MICRO-SD-SOCKET-PP = smd 0.8 x 1.5: 1 -8.94,10.7; 2 -7.84,10.3; 3 -6.74,10.7; 4 -5.64,10.9; 5 -4.54,10.7; 6 -3.44,10.9; 7 -2.34,10.7; 8 -1.24,10.7 | smd 1.8 x 1.4: CD1 -2.05,0.4; CD2 -7.75,0.4 | smd 1.4 x 1.9: GND1 -13.6,14.55; GND3 -0.45,13.55
ZX62R-B-5P = smd 1.35 x 0.4: 1 2.675,-1.3; 2 2.675,-0.65; 3 2.675,0; 4 2.675,0.65; 5 2.675,1.3 | smd 1.9 x 1.6: M1 0,-4.1; M2 0,4.1 | smd 2 x 2.1: M3 2.35,3.1; M4 2.35,-3.1

### Placement (x,y rotation side)
406C35E  50.13,42.59 0 top
2141  60.27,32.33 180 top
ADC_SEN1  5.04,58.37 90 top
ADC_SEN2  4.83,45.86 90 top
ADC_SEN3  4.71,34.11 90 top
BLUE  65.72,56.13 90 top
BOOT0  27.16,5.42 180 top
C1  32.08,17.61 270 top
C2  41.87,16.91 270 top
C3  33.26,31.82 90 top
C4  52.04,47.12 0 top
C5  43.9,39.38 180 top
C6  48.49,37 90 top
C7  39.33,49.32 0 top
C8  48.22,21.61 0 top
C9  31.94,22.57 270 top
C10  50.46,32.48 0 top
C11  36.94,37.48 90 top
C12  39.03,37.51 90 top
C13  33.98,22.56 270 top
C14  44.17,48.32 0 top
C15  53.3,51.98 0 top
C16  63.39,32.6 270 top
C17  24.97,41.22 90 top
C18  33.35,41.6 0 top
C19  32.97,46.68 0 top
C20  22.17,41.02 90 top
C21  21.31,55.24 180 top
D2  63.92,24.83 90 top
EJECT  36.43,5.55 0 top
GPIOS  10.15,9.34 0 top
GREEN  59.38,56.03 90 top
HSMS-2824-BLKG  39.34,54.16 270 top
IC1  24.21,34.36 90 top
JP1  10.12,58.21 0 top
PROGRAM  27.66,12.82 0 top
R1  44.85,42.71 270 top
R2  36.77,17.23 90 top
R3  6.05,14.55 270 top
R4  25.6,51 0 top
R5  2.62,14.8 270 top
R6  62.56,36.01 180 top
R7  10.11,14.93 270 top
R8  13.54,14.93 270 top
R9  17.06,53.7 180 top
R10  66.47,19.12 270 top
R11  44.97,17.37 270 top
R12  12.13,53.84 180 top
R13  30.05,37.28 90 top
R14  26.75,46.81 180 top
R15  66.48,32.59 90 top
R16  55.97,36.62 180 top
R17  17.6,14.93 270 top
R18  21.79,14.8 270 top
R19  49.63,16.12 0 top
R20  57.35,20.26 270 top
R21  48.83,12.17 180 top
R22  43.94,12.25 0 top
R23  55.45,30.13 180 top
R24  53.72,20.44 270 top
R25  40.11,12.21 270 top
R26  25.6,54.3 0 top
R27  16.99,42.79 0 top
R28  59.06,60.45 270 top
R29  62.52,60.5 90 top
R30  65.74,60.54 90 top
R31  23.32,28.9 180 top
R32  17.25,38.98 0 top
R33  18.36,28.52 180 top
R34  35.51,13.15 0 top
RCLAMP  33.73,52.9 180 top
RED  62.59,56.12 90 top
RESET  45.57,5.55 180 top
RXLED  18.52,35.17 180 top
S1  52.15,58.75 180 top
SUPERCAP  55.08,25.91 0 top
SWD_DEBUG_PORT  60.91,45.03 180 top
T1  62.63,19.35 270 top
TO_BATTERY  44.82,58.67 90 top
TP1  64.47,38.17 0 top
TP2  56.93,33.44 0 top
TP3  61.75,38.04 0 top
TP4  52.27,37.66 0 top
TP9  2.18,18.86 180 top
TP14  5.3,18.97 0 top
TP15  9.1,19.26 0 top
TP16  12.79,18.91 0 top
TP17  17.59,18.37 0 top
TP18  21.66,18.23 0 top
TPS73233  40.08,44.49 0 top
TVS1  3.73,23.63 90 top
TVS2  8.6,24.04 90 top
TVS3  13.3,24.55 90 top
TVS4  17.87,22.39 90 top
TVS5  22.58,22.66 90 top
TVS6  27.58,22.49 90 top
TVS7  11.19,42.81 0 top
TVS9  11.57,31.76 0 top
TVS10  11,37.56 0 top
TVS11  12.03,48.68 180 top
TVS12  19.52,49.06 0 top
TVS13  46.3,51.51 0 top
TXLED  18.52,32.13 180 top
U1  41.75,28.11 270 top
U2  52.1,1.75 270 top
USB_FS  25.34,61.69 270 top
USBTOUART  36.8,61.59 270 top

### Tracks (layer width: path | path; a pad name or v marks a point on that pad's centre or on a via)
+3V3  (via drill 0.5)
  Top 0.254: C8.1 46.62,22.26 U1.48 45.5,20.84 v45.8,20.54 | C11.1 36.97,36.56 C12.1 39.5,36.09 U1.13 39.47,33.93 39.47,32.86 39.4,32.79 39.09,32.79 37.16,30.86 U1.19 C3.1 | U1.64 48.89,31.86 C10.1 49.51,34.11 49.63,34.23 50.34,34.23 v50.37,34.26 | v37.39,24.63 37.11,24.36 U1.32 33.97,24.36 C13.1 31.94,23.51 C9.1
  Top 0.406: R31.2 v20.85,28.98 | R33.2 v16.08,28.52 | R6.2 v60.25,36.01 | R16.2 53.83,36.62 v53.57,36.62 | SWD_DEBUG_PORT.1 v63.45,48.99 | R30.2 65.7,61.45 R29.2 62.47,61.4 R28.1 57.34,61.4 v57.33,61.41 | ADC_SEN3.1 3.13,30.17 v3.02,30.09 | ADC_SEN2.1 4.9,41.88 v4.8,41.65 | ADC_SEN1.1 5.11,54.05 v5.13,53.94 | R12.2 v11.18,55.39 | JP1.2 12.66,60.08 v12.65,60.09 | R34.2 36.46,11.54 v36.47,11.53 | D2.A 63.92,24.39 v63.96,24.43 | R10.1 63.87,20.07 T1.2 67.99,20.29 v68.22,20.06 | R32.2 18.14,38.98 18.14,40.25 19.05,40.25 v19.05,40.61 | R27.1 14.66,42.79 14.66,41.47 13.82,41.47 13.82,41.35 13.79,41.35 v13.79,41.02 | C7.1 39.13,49.32 TPS73233.5 38.15,45.79 38.15,43.99 v37.31,43.99 37.31,40.23 37.29,40.23 37.29,40.05 35.56,40.05 35.56,36.53 C11.1 | R9.2 16.11,52.34 v16.46,51.99 | R15.2 66.45,33.54 66.45,35.5 v65.91,36.04
  +3V3 0.254: v37.39,24.63 37.67,24.91 | v45.8,20.54 45.82,20.54 46.08,20.29 | v50.37,34.26 50.9,34.26
  +3V3 0.406: v20.85,28.98 20.85,28.9 | v16.08,28.52 15.72,28.52 15.7,28.54 | v60.25,36.01 59.87,36.01 | v53.57,36.62 53.24,36.62 | v63.45,48.99 63.45,49.14 63.42,49.17 | v57.33,61.41 56.9,61.41 56.87,61.44 | v3.02,30.09 2.54,29.71 2.39,29.66 | v4.8,41.65 4.8,40.99 4.83,40.91 | v5.13,53.94 5.21,53.44 5.21,53.31 | v11.18,55.39 11.18,55.87 11.15,55.9 | v12.65,60.09 12.65,60.6 12.67,60.62 | v36.47,11.53 36.47,11.15 | v63.96,24.43 63.96,24.94 63.93,24.96 | v19.05,40.61 19.05,40.89 | v13.79,41.02 13.79,40.69 | v37.31,43.99 36.93,43.99 | v16.46,51.99 16.76,51.68 | v68.22,20.06 68.45,19.83 | v65.91,36.04 65.91,36.06 65.63,36.34
  pour +3V3 (isolate 0.305): -0.03,63.62 71.73,63.62 71.73,-0.01 -0.03,-0.13
BLUE  (via drill 0.5)
  Top 0.254: U1.17 35.07,31.86 34.82,31.87 v34.7,34.28 | 9.02,42.83 TVS7.A
  Top 0.406: v34.75,44.72 9.02,44.72 9.02,42.83 | TVS7.A 7.66,42.81 7.65,42.82 7.65,58.16 7.39,58.41 5.09,58.41 ADC_SEN1.2
  Bottom 0.254: 34.7,44.67 v34.75,44.72
  Bottom 0.406: v34.7,34.28 34.7,44.67
BOOT0  (via drill 0.5)
  Top 0.254: U1.60 46.72,29.86 45.52,31.06 40.21,31.06 v40.18,31.03 | v40.08,18.18 R2.2
  Bottom 0.254: v40.18,31.03 40.18,18.28 v40.08,18.18
DEBUG_LED/NP1
  Top 0.406: GPIOS.1 3.8,11.05 2.62,12.24 R5.2
DEBUG_LED/NP2
  Top 0.406: R3.2 6.05,9.63 GPIOS.2
DEBUG_LED/NP3
  Top 0.406: GPIOS.3 8.88,11.72 9.22,12.06 9.93,12.06 10.06,12.19 10.06,13.93 R7.2
DEBUG_LED/NP4
  Top 0.406: R8.2 13.54,13.13 11.48,11.07 11.48,9.4 GPIOS.4
DEBUG_LED/NP5
  Top 0.406: R17.2 17.6,11.73 17.55,11.68 14.66,11.68 13.97,10.99 GPIOS.5
DEBUG_LED/NP6
  Top 0.406: GPIOS.6 21.48,9.34 21.77,9.62 21.77,13.83 R18.2
DM  (via drill 0.5)
  Top 0.305: USBTOUART.2 36.15,57.29 36.4,57.04 36.4,53.33 36.27,53.21 31.52,53.21 31.47,53.26 30.51,53.26 v30.3,53.06 | C19.1 31.92,46.78 v30.23,46.78 30.2,46.81 R14.1
  Bottom 0.305: v30.3,53.06 30.3,46.86 v30.23,46.78
DM_IN/FS
  Top 0.406: USB_FS.2 24.69,57.83 23.55,56.69 23.55,51 23.57,50.97 24.63,50.97 R4.1
DM_OUT/FS  (via drill 0.5)
  Top 0.254: U1.44 43.5,23.93 43.46,23.97 43.46,26.79 v42.98,27.27
  Top 0.406: RCLAMP.4 32.78,49.64 32.79,49.63 32.54,49.63 | 32.54,49.63 26.67,49.63 26.54,49.75 26.54,50.99 R4.2 | v36.96,48.48 33.68,48.48 32.54,49.63
  Bottom 0.254: v42.98,27.27 42.98,31.69 42.9,31.69 41.76,32.84 40.06,32.84 39.98,32.91 39.98,33.88 38.3,35.55
  Bottom 0.406: 38.3,35.55 38.28,35.55 38.15,35.68 38.15,48.48 37.95,48.69 37.16,48.69 v36.96,48.48
DP  (via drill 0.5)
  Top 0.305: USBTOUART.3 36.8,57.42 37.08,57.14 37.08,52.67 37.06,52.65 31.45,52.65 v31.45,52.12
  Top 0.406: v31.45,43.33 31.45,41.57 31.5,41.52 32.32,41.52 C18.1 32.4,38.36 32.31,38.27 30.09,38.27 R13.2
  Bottom 0.406: v31.45,52.12 v31.45,43.33
DP_IN/FS
  Top 0.406: R26.1 24.65,56.93 25.35,57.63 25.35,59 USB_FS.3
DP_OUT/FS  (via drill 0.5)
  Top 0.254: U1.45 44,23.97 43.94,24.02 43.94,28.29 v43.92,27.96
  Top 0.406: RCLAMP.3 32.78,54.93 | 32.78,54.93 32.78,55.81 32.74,55.85 26.87,55.85 26.52,55.49 26.52,54.34 R26.2 | v31.19,54.12 31.97,54.12 32.78,54.93
  Bottom 0.254: v43.92,27.96 43.92,32.53 43.89,32.56 42.8,32.56 41.99,33.37 41,33.37 40.64,33.73 40.64,34.31 38.84,36.11
  Bottom 0.406: 38.84,36.11 38.84,52.67 38.79,52.72 32.59,52.72 v31.19,54.12
GND  (via drill 0.5)
  Top 0.254: C3.2 33.29,32.74 34.26,32.74 34.26,31.87 34.63,31.36 U1.18 34.73,31.36 33.48,32.61 33.48,33.12 v32.36,34.23 | U1.63 51.39,31.36 51.43,31.31 51.43,32.45 C10.2 | U1.12 40,35.5 40.26,35.76 40.26,35.86 40.94,36.55 v40.94,38.83 | IC1.13 23.89,35.41 v24.05,35.25 | IC1.5 24.52,33.23 24.51,33.24 23.62,33.24 v23.57,33.29
  Top 0.305: U1.63 46.44,31.36 45.87,31.92 v44.75,31.92 | C8.2 49.17,20.74 v47.93,19.5 | USBTOUART.M3 41.67,59.24 41.68,59.23 41.68,61.51 41.61,61.59 USBTOUART.M2
  Top 0.406: USB_FS.5 28.11,59.01 USB_FS.M3 | USBTOUART.5 39.58,58.91 USBTOUART.M3
  other vias: 14.91,51.73 11.38,40.23 8.94,51 23.85,48.74 29.51,43.58 2.79,38.73 7.8,60.02 21.34,51.99 56.57,46.96 61.14,13.33 26.9,9.27 40.82,5.46 46.74,5.81 28.32,17.42 19.94,11.65 17.68,22.68 36.75,45.36 31.06,58.95 64.92,34.82 58.55,35.28 41.94,14.55 39.98,47.37 40.01,44.57 49.61,59.66 61.34,51.05 56.95,53.06 68.48,59 55.07,3.91 20.55,7.16 18.9,2.94 28.47,53.21 61.16,26.82
  pour Bottom (isolate 0.305): -0.15,63.62 71.73,63.75 71.6,-0.13 -0.03,-0.13
  pour GND (isolate 0.254): -0.03,63.62 71.6,63.75 71.86,-0.13 -0.03,-0.13
  pour Top (isolate 0.305): -0.04,63.62 71.72,63.75 71.85,-0.13 -0.04,-0.13
GPIO1  (via drill 0.5)
  Top 0.254: U1.22 32.82,29.36 32.79,29.33 26.49,29.33 v25.63,30.2
  Top 0.406: R5.1 2.18,16.19 TP9.TP 3.73,20.41 TVS1.A 3.66,21.55 v3.66,23.62
  Bottom 0.406: v25.63,30.2 4.39,30.2 3.66,29.46 v3.66,23.62
GPIO2  (via drill 0.5)
  Top 0.254: U1.41 42,20.05 41.96,20.01 39.24,20.01 39.22,20.04 38,20.04 37.54,20.49 v36.02,20.49 | v10.26,21.89 TVS2.A
  Top 0.406: TVS2.A 8.23,21.89 TP14.TP 5.3,16.24 R3.1
  Bottom 0.254: v36.02,20.49 11.66,20.49 v10.26,21.89
GPIO3  (via drill 0.5)
  Top 0.254: U1.43 43,19.7 42.88,19.58 39.42,19.58 39.4,19.6 37.69,19.6 37.36,19.93 36.75,19.93 36.53,19.7 v35.33,19.7 | v11.53,19.78 10.49,19.78 10.06,20.22
  Top 0.406: TVS3.A 12.24,22.4 10.06,20.22 TP15.TP 9.1,16.89 R7.1
  Bottom 0.254: v35.33,19.7 32.66,19.7 32.61,19.76 11.56,19.76 v11.53,19.78
GPIO4  (via drill 0.5)
  Top 0.254: U1.8 42,32.95 41.86,32.81 41.3,32.81 40.54,32.05 v39.29,32.05
  Top 0.305: v12.55,33.42 12.55,29.74 15.34,26.94 15.34,20.52 15.06,20.24
  Top 0.406: TVS4.A 15.06,20.24 13.21,20.24 12.78,19.81 12.78,18.92 TP16.TP 12.79,16.63 R8.1 | v28.68,31.92 28.02,31.92 v28.02,34.11
  Bottom 0.254: v39.29,32.05 38.28,32.05 38.15,32.18 32.03,32.18 31.8,32.4 29.16,32.4 v28.68,31.92
  Bottom 0.305: 23.98,32.56 23.95,32.56 23.8,32.4 13.89,32.4 12.88,33.42 v12.55,33.42
  Bottom 0.406: v28.02,34.11 25.5,34.11 24.31,32.91 24.31,32.89 23.98,32.56
GPIO5  (via drill 0.5)
  Top 0.254: U1.34 38.5,23.14 38.43,23.21 36.35,23.21 v36.17,23.03 | v22.58,23.16 TVS5.A | TVS5.A
  Top 0.406: TVS5.A 20.47,20.51 20.32,20.37 20.32,18.43 20.24,18.36 17.6,18.36 TP17.TP 17.59,15.89 R17.1
  Bottom 0.254: v36.17,23.03 22.71,23.03 v22.58,23.16
GPIO6  (via drill 0.5)
  Top 0.254: U1.35 39,23.56 38.86,23.69 38.86,23.74 v38.68,23.92 | v25.35,23.95 25.35,20.54 25.6,20.29 27.53,20.29 TVS6.A
  Top 0.406: TVS6.A 27.58,18.53 27.28,18.23 TP18.TP | TP18.TP | TP18.TP 21.66,15.88 R18.1
  Bottom 0.254: v38.68,23.92 25.37,23.92 v25.35,23.95
GREEN  (via drill 0.5)
  Top 0.254: U1.16 38,34.82 37.95,34.87 35.86,34.87 35.61,35.12 v33.58,35.12
  Top 0.406: v10.92,37.51 8.89,37.51 TVS10.A 7.04,37.56 7.01,37.59 7.01,45.79 6.93,45.87 ADC_SEN2.2
  Bottom 0.406: v33.58,35.12 28.27,35.12 26.44,36.95 11.48,36.95 v10.92,37.51
I2C1_SCL  (via drill 0.5)
  Top 0.254: U1.58 46.02,28.86 45.59,29.28 39.07,29.28 v39.01,29.23
  Top 0.406: JP1.4 18.01,57.94 R9.1 18.01,50.77 17.37,50.13 17.37,49.55 | 17.37,49.55 TVS12.A | v31.34,31.59 31.34,35 33.45,37.1 v33.45,39.16 | v26.85,43.73 23.06,43.73 v23.04,43.71 | v23.06,46.07 17.45,46.07 17.42,46.04 17.42,49.5 17.37,49.55
  Bottom 0.406: v39.01,29.23 39.01,30.55 38,31.57 31.37,31.57 v31.34,31.59 | v33.45,39.16 31.42,39.16 v26.85,43.73 | v23.04,43.71 23.04,46.04 v23.06,46.07
I2C1_SDA  (via drill 0.5)
  Top 0.254: U1.59 46.43,29.36 45.62,30.17 37.97,30.17 v37.9,30.25
  Top 0.406: JP1.3 15.19,58.19 15.19,56.28 15.06,56.15 13.28,56.15 13.08,55.95 R12.1 13.08,51.64 14.22,50.49 14.22,48.73 TVS11.A 14.22,48.64 v14.22,46.2
  Bottom 0.406: v37.9,30.25 27,30.25 26.24,31.01 10.11,31.01 10.11,36.6 9.3,37.41 9.3,39.36 9.4,39.47 9.4,41.37 v14.22,46.2
N$1
  Top 0.254: U1.31 30.96,24.86 30.51,24.4 30.51,18.82 30.76,18.56 C1.1
N$2
  Top 0.254: U1.47 45,19.67 44.93,19.6 43.59,19.6 43.51,19.53 43.51,17.95 43.43,17.88 41.88,17.88 C2.1
N$3  (via drill 0.5)
  Top 0.254: U1.4 44,35.46 44.2,35.66 46.84,35.66 46.86,35.68 v46.86,36.52
  Top 0.406: v59.36,53.36 59.36,54.96 GREEN.C
  Bottom 0.406: v46.86,36.52 46.86,38.42 46.96,38.53 54.41,38.53 54.48,38.6 54.48,49.3 54.61,49.42 59.23,49.42 59.36,49.55 v59.36,53.36
N$4
  Top 0.406: TO_BATTERY.3 42.73,61.21 42.72,61.21 42.72,58.9 40.21,56.38 38.33,56.38 38.25,56.31 HSMS-2824-BLKG.1
  Top 0.813: HSMS-2824-BLKG.1
N$5
  Top 0.406: C4.1 51.09,45.38 | 51.09,45.38 51.09,43.82 51.21,43.71 52.25,43.71 406C35E.3 | R1.1 44.85,44.95 45.08,45.18 50.89,45.18 51.09,45.38
N$6
  Top 0.406: BOOT0.4 BOOT0.3 29.95,9.14 30.07,9.27 33.1,9.27 33.25,9.42 33.25,15.16 33.38,15.29 36.68,15.29 36.75,15.36 36.75,16.27 R2.1
N$7  (via drill 0.5)
  Top 0.254: IC1.10 IC1.11 | IC1.10 25.79,40.06 25.63,40.23 25.01,40.23 C17.1 | IC1.3 23.25,32.34 v22.48,33.12 | v25.65,35.33 25.7,35.33 25.78,35.4 25.78,37.07 IC1.10
  Bottom 0.254: v22.48,33.12 22.12,33.47 22.12,35.99 22.2,36.06 24.26,36.06 24.97,35.35 25.63,35.35 v25.65,35.33
N$8  (via drill 0.5)
  Top 0.305: R14.2 24.36,46.81 v24.28,46.73 | v26.95,39.11 26.95,38.5 26.44,37.99 26.44,37.09 IC1.9
  Bottom 0.305: v24.28,46.73 24.28,41.78 v26.95,39.11
N$9
  Top 0.406: R13.1 30.05,30.63 26.59,30.63 26.54,30.68 26.47,30.68 26.44,30.7 26.44,31.63 IC1.8
N$10
  Top 0.406: TPS73233.4 41.03,47.68 41.73,48.38 43.16,48.38 C14.1
N$11
  Top 0.406: BOOT0.2 BOOT0.1 31.84,3.51 31.85,3.5 31.85,8.55 31.93,8.63 34.44,8.63 34.57,8.5 34.57,13.14 R34.1
N$12
  Top 0.406: TXLED.A 15.82,32.13 15.04,32.91 15.04,40.99 17.96,40.99 17.96,42.78 R27.2
N$13  (via drill 0.5)
  Top 0.254: U1.62 52.17,30.86 52.22,30.91 52.25,30.91 53.57,32.23 v53.57,33.9 | 65.76,55.04 BLUE.C
  Top 0.406: v65.76,52.93 65.76,55.04
  Bottom 0.254: 66.98,33.9 67.08,34.01 | 67.08,52.78 66.93,52.93
  Bottom 0.406: v53.57,33.9 66.98,33.9 | 67.08,34.01 67.08,52.78 | 66.93,52.93 v65.76,52.93
N$14
  Top 0.406: R22.2 44.89,10.59 44.88,10.59 49.73,10.59 49.78,10.64 R21.1 52.41,12.17 52.48,12.24 52.48,9.52 U2.CD2 U2.CD1
N$15
  Top 0.406: D2.C 63.03,26.98 59.97,23.92 56.44,23.92 56.39,23.97 56.39,30.11 R23.1
N$16
  Top 0.406: R29.1 62.52,57.24 RED.A
N$17
  Top 0.406: R28.2 59.06,57.4 GREEN.A
N$18
  Top 0.406: R30.1 65.74,57.19 BLUE.A
N$19
  Top 0.406: RXLED.A 16.36,35.17 16.31,35.22 16.31,38.97 R32.1
N$20  (via drill 0.5)
  Top 0.254: U1.61 52.54,30.36 v52.81,30.37
  Top 0.406: v63.35,53.36 62.61,53.36 62.56,53.41 62.56,55.05 RED.C
  Bottom 0.406: v52.81,30.37 65.3,30.4 65.53,30.63 65.53,30.8 67.67,32.94 67.67,54.96 67.56,55.06 65.05,55.06 v63.35,53.36
N$21
  Top 0.406: S1.3 49.65,54.11 49.61,54.07 44.2,54.07 44.15,54.12 TVS13.A | TVS13.A 40.59,51.51 40.46,51.63 40.46,54.14
  Top 0.813: TVS13.A | 40.46,54.14 HSMS-2824-BLKG.3
N$22
  Top 0.254: IC1.14 23.25,35.26 23.16,35.17 RXLED.C
N$23
  Top 0.254: IC1.7 25.79,33.87 25.58,34.08 20.19,34.08 19.56,33.45 TXLED.C
N$26
  Top 0.254: 45,18.28 R11.1
  Top 0.406: R25.1 42.08,13.16 42.53,12.71 | 42.53,12.71 R22.1 | R19.1 48.68,17.96 48.36,18.28 | 48.36,18.28 45,18.28 44.04,18.28 43.99,18.33 43.99,17.77 43.46,17.24 43.46,13.63 42.53,12.71 | U2.4 64.57,7.39 64.59,7.41 64.59,14.47 61.62,17.44 T1.1 61.62,20.6 61.54,20.67 57.9,20.67 R20.1 53.9,21.21 R24.1 51.19,21.39 51.18,21.38 51.18,21.1 48.36,18.28
OSC_IN
  Top 0.254: U1.5 43.5,35.64 43.97,36.11 44.75,36.11 44.86,36.21 C5.1
  Top 0.406: 406C35E.1 47.93,39.67 47.65,39.39 44.86,39.39 C5.1
OSC_OUT  (via drill 0.5)
  Top 0.254: U1.6 43,35.85 43.76,36.62 v43.76,37.23
  Top 0.406: v43.15,40.81 43.15,41.68 43.23,41.75 R1.2
  Bottom 0.406: v43.76,37.23 43.76,40.2 v43.15,40.81
PROGRAMMING_EN  (via drill 0.5)
  Top 0.254: U1.33 38,21.25 37.97,21.23 36.88,21.23 v36.86,21.25 | v32.46,14.73 PROGRAM.2
  Top 0.406: PROGRAM.1 PROGRAM.2
  Bottom 0.254: v36.86,21.25 36.86,14.98 36.55,14.68 32.51,14.68 v32.46,14.73
RED  (via drill 0.5)
  Top 0.254: U1.15 38.5,33.06 38.13,32.68 37.11,32.68 v36.55,33.24 | v11.61,32.05 9.71,32.05 TVS9.A
  Top 0.406: TVS9.A 9.05,31.76 6.71,34.11 ADC_SEN3.2
  Bottom 0.254: v36.55,33.24 28.57,33.24 27.99,32.66 26.24,32.66 25.3,31.72 11.94,31.72 v11.61,32.05
RESET  (via drill 0.5)
  Top 0.254: v42.49,36.49 v42.5,36.49 U1.7 42.5,32.87 v41.53,31.9 | v48.49,34.39 C6.1 | v41.58,24.66 39.85,24.66 v39.45,25.06
  Top 0.406: C6.1 52.21,36.05 52.27,36.11 TP4.TP 52.68,38.07 58.34,38.07 58.37,38.09 SWD_DEBUG_PORT.10 | RESET.3 RESET.4 40.36,9.88 v37.46,9.88
  Bottom 0.254: v42.49,36.49 45.47,36.49 47.6,34.36 48.46,34.36 v48.49,34.39 | v41.53,31.9 41.53,28.11 41.55,28.09 41.55,24.68 v41.58,24.66 | v39.45,25.06 39.45,22.83 37.92,21.31 37.92,11.68 37.46,11.22 v37.46,9.88
SD_DETECT  (via drill 0.5)
  Top 0.254: U1.25 31.22,27.86 30.68,27.32 29.44,27.32 v29.41,27.35
  Top 0.406: v27.28,26.33 24.18,26.33 24.16,26.31 24.16,19.15 v24.13,19.07 | v28.47,12.42 v30.86,12.42 | v36.04,8.58 39.65,8.58 v39.78,8.71 | v46.63,13.89 47.42,13.89 47.9,13.41 47.9,12.19 R21.2
  Bottom 0.406: v29.41,27.35 28.3,27.35 v27.28,26.33 | v24.13,19.07 24.13,12.42 24.18,12.36 28.42,12.36 v28.47,12.42 | v30.86,12.42 32.21,12.42 v36.04,8.58 | v39.78,8.71 41.2,8.71 42.7,10.21 43.84,10.21 44.17,9.88 46.46,9.88 46.51,9.93 46.51,13.76 v46.63,13.89
SD_EJECT  (via drill 0.5)
  Top 0.254: U1.24 30.51,28.36 v30.35,28.52 | 29.54,18.97 v29.57,18.94
  Top 0.406: EJECT.2 EJECT.1 v33.63,5.46 | v29.54,24.63 29.54,18.97
  Bottom 0.254: v30.35,28.52 30.35,25.45 v29.54,24.63
  Bottom 0.406: v29.57,18.94 29.57,5.4 29.64,5.33 33.5,5.33 v33.63,5.46
SD_PWR_EN  (via drill 0.5)
  Top 0.254: U1.23 38.14,28.86 38.15,28.85 38.2,28.85 39.07,27.99 42.37,27.99 43.15,28.77 45.21,28.77 46,27.99 v46,25.34 | v49.48,18.21 49.45,18.28 50.01,18.84
  Top 0.406: R10.2 66.28,18.36 T1.3 v63.65,16.99 | 50.01,18.84 50.85,18.84 52.76,16.94 52.78,16.94 52.91,16.81 56.34,16.81 56.74,16.4 61.16,16.4 v61.19,16.43
  Bottom 0.254: v46,25.34 46.15,25.34 48.74,22.75 48.74,18.87 v49.48,18.21
  Bottom 0.406: v61.19,16.43 63.09,16.43 v63.65,16.99
SDIO_CK  (via drill 0.5)
  Top 0.254: U1.53 v50.57,26.36
  Top 0.406: v53.7,12.87 53.7,12.62 60.02,6.29 U2.5
  Bottom 0.254: v50.57,26.36 52.58,26.36 52.6,26.33 52.6,16.94 52.65,16.89
  Bottom 0.406: 52.65,16.89 52.65,13.91 v53.7,12.87
SDIO_CMD  (via drill 0.5)
  Top 0.254: U1.54 49.8,26.86 50.39,27.45 50.42,27.45 v50.62,27.66
  Top 0.406: U2.3 58.84,8.49 v57.35,9.98 | v57.35,17.29 R20.2
  Bottom 0.254: v50.62,27.66 55.65,27.66 55.96,27.35 55.96,18.69 v57.35,17.29
  Bottom 0.406: v57.35,9.98 v57.35,17.29
SDIO_D0  (via drill 0.5)
  Top 0.254: U1.39 v41,23.67 | v46.99,16.43 R11.2
  Top 0.406: U2.7 60.68,4.09 v53.7,11.07
  Bottom 0.254: v41,23.67 46.91,23.67 46.99,23.59 v46.99,16.43
  Bottom 0.406: v53.7,11.07 53.64,11.07 48.31,16.4 47.02,16.4 v46.99,16.43
SDIO_D1  (via drill 0.5)
  Top 0.254: U1.40 41.5,20.51 41.48,20.49 39.57,20.49 39.55,20.52 39.55,20.57 v39.32,20.8 | v38.61,11.27 40.1,11.27 R25.2
  Top 0.406: U2.8 58.63,2.99 v53.75,7.87 | v50.19,9.06 42.31,9.06 R25.2
  Bottom 0.254: v39.32,20.8 38.94,20.8 38.91,20.82 38.58,20.82 38.58,11.3 v38.61,11.27
  Bottom 0.406: v53.75,7.87 51.38,7.87 v50.19,9.06
SDIO_D2  (via drill 0.5)
  Top 0.254: U1.51 49.59,25.36 v50.52,24.43 | v50.55,17.95 50.55,16.16 R19.2
  Top 0.406: U2.1 59.92,10.69 54.48,16.12 R19.2
  Bottom 0.254: v50.52,24.43 50.52,20.64 50.55,20.62 v50.55,17.95
SDIO_D3  (via drill 0.5)
  Top 0.254: U1.52 49.96,25.86 51.03,25.01 51.05,25.01 51.33,24.73 51.33,24.12 51.38,24.07 v51.74,24.07 | v51.74,19.48 53.71,19.48 R24.2
  Top 0.406: U2.2 59.44,9.59 54.79,14.24 v53.72,14.24 | v53.72,17.67 R24.2
  Bottom 0.254: v51.74,24.07 v51.74,19.48
  Bottom 0.406: v53.72,14.24 v53.72,17.67
SWCK  (via drill 0.5)
  Top 0.254: U1.49 49.42,24.36 50.72,23.06 59,23.06 v59.03,23.03
  Top 0.406: TP3.TP 62.18,38.48 SWD_DEBUG_PORT.4 62.23,43.23 62.23,45 62.28,45.05 64.06,45.05 64.97,44.14 64.97,39.67 65.38,39.26 v69.37,39.26
  Bottom 0.406: v59.03,23.03 59.99,23.03 60.63,22.4 69.06,22.4 69.19,22.52 69.19,39.09 v69.37,39.26
SWDIO  (via drill 0.5)
  Top 0.254: U1.46 44.5,23.32 44.48,23.34 46.23,23.34 46.71,22.85 50.32,22.85 50.72,22.45
  Top 0.305: 69.21,21.36 69.24,21.38
  Top 0.406: 50.72,22.45 58.29,22.45 59.39,21.36 69.21,21.36 | 69.24,21.38 v70.08,21.38 | v69.95,37.97 64.67,37.97 TP1.TP | TP1.TP 63.53,37.23 63.53,36.03 R6.1 | TP1.TP 64.47,38.83 63.45,39.85 SWD_DEBUG_PORT.2
  Bottom 0.406: v70.08,21.38 70.08,37.84 v69.95,37.97
USART3_RX
  Top 0.254: U1.29 29.38,25.86 27.28,27.96 24.28,27.96 24.21,28.04 24.21,28.84 R31.1 24.27,30.06 23.88,30.45 23.88,31.63 IC1.4
USART3_TX
  Top 0.254: U1.30 29.27,25.36 27.2,27.43 19.46,27.43 19.33,27.55 19.33,28.5 R33.1
  Top 0.406: IC1.1 21.98,30.59 21.87,30.47 19.56,30.47 19.28,30.2 19.28,28.55 R33.1
USB/FS_OVERCURRENT  (via drill 0.5)
  Top 0.254: U1.10 41,35.48 v40.97,35.5 | v56.26,32.2 56.92,32.2 56.97,32.25 56.97,33.4 TP2.TP
  Top 0.406: R16.1 TP2.TP 57.11,33.63 2141.3
  Bottom 0.254: v40.97,35.5 45.77,35.5 48.11,33.17 55.3,33.17 v56.26,32.2
USB/FS_POWERSWITCHON  (via drill 0.5)
  Top 0.254: U1.57 48.66,28.36 49.3,29 49.91,29 v49.94,29.03 | v59.28,29.03 59.28,30.99 2141.4
  Top 0.406: R15.1 66.48,30.29 v66.52,30.25
  Bottom 0.254: v49.94,29.03 v59.28,29.03
  Bottom 0.406: v66.52,30.25 66.52,28.59 66.6,28.52 59.79,28.52 v59.28,29.03
VBAT  (via drill 0.5)
  Top 0.254: R23.2 54.5,31.83 v54.46,31.87 | v47.02,32.79 47.02,34.13 45.97,35.17 45.59,35.17 45.57,35.2 45.5,35.13 U1.1
  Top 0.406: SUPERCAP.+ 54.31,25.91 54.51,26.11 R23.2
  Bottom 0.254: v54.46,31.87 53.85,32.48 47.32,32.48 v47.02,32.79
VBUS/FS  (via drill 0.5)
  Top 0.254: IC1.12 24.52,38.62 24.43,38.7 22.35,38.7 22.2,38.86 22.2,40.04 C20.1 | U1.42 v42.5,26.05 v42.49,26.05
  Top 0.305: v42.49,26.05 37.8,26.05 v37.74,26.11 | v6.78,29.08 6.78,31.36 v7.34,31.92
  Top 0.406: HSMS-2824-BLKG.2 38.24,51.35 38.3,51.33 | 38.3,51.33 36.32,51.33 36.32,49.75 36.27,49.7 v33.91,49.7 33.71,49.91 33.71,51.38 RCLAMP.5 | C16.1 61.3,33.55 2141.1 61.16,33.57 61.16,32.33 57.91,32.33 v57.91,28.11 | v30.68,41.29 30.15,41.29 29.06,40.13 29.06,40.1 v28.6,39.64 | v25.1,38.91 24.59,38.91 24.52,38.62 | v8.94,33.52 10.87,33.52 11.53,34.18 11.56,34.18 v11.84,34.46 | v20.85,35.91 20.78,40.02 20.85,40.1 22.14,40.1 C20.1 | v41.68,55.75 v41.68,52.57 | v40.06,50.77 38.79,50.77 38.3,51.33
  Bottom 0.254: v42.49,26.05 47.73,26.05 49.81,28.14 49.96,28.14 50.16,28.34 50.34,28.34 50.52,28.52 57.51,28.52 v57.91,28.11
  Bottom 0.305: v37.74,26.11 34.26,26.11 31.01,29.36 24.46,29.36 23.27,28.16 17.86,28.16 16.46,29.56 8.2,29.56 7.65,29 6.86,29 v6.78,29.08
  Bottom 0.406: v33.91,49.7 33.91,45.31 33.32,44.72 33.32,41.4 33.22,41.29 v30.68,41.29 | v28.6,39.64 28.6,38.15 25.88,38.15 v25.1,38.91 | v7.34,31.92 v8.94,33.52 | v11.84,34.46 19.38,34.46 v20.85,35.91 | TO_BATTERY.2 43.86,58.67 41.66,56.46 41.66,55.77 v41.68,55.75 | v41.68,52.57 41.68,50.74 40.08,50.74 v40.06,50.77
VBUS/FS_IN  (via drill 0.5)
  Top 0.406: 2141.5 61.22,29.29 | 61.22,29.29 61.19,29.26 | v68.43,29.38 68.3,29.26 65.51,29.26 v65.38,29.38 | v35.51,56.76 USBTOUART.1 | USB_FS.1 24.04,58.07 23.39,57.42 22.3,57.42 | 22.3,57.42 v22.28,57.45 | 22.3,57.42 22.3,55.28 C21.1 | v62.08,29.41 61.34,29.41 61.22,29.29
  Bottom 0.406: v68.43,29.38 68.43,55.9 67.92,56.41 48.01,56.41 47.88,56.53 47.88,55.54 45.75,53.41 35.53,53.41 35.51,53.44 v35.51,56.76 34.82,57.45 v22.28,57.45 | v65.38,29.38 62.1,29.38 v62.08,29.41
VIN  (via drill 0.5)
  Top 0.406: S1.2 52.15,52.19 | C15.1 52.35,49.38 | TPS73233.3 41.05,43.17 v41.05,41.02 39.07,41.02 39.13,41.08 TPS73233.1
  Top 0.813: 52.15,52.19 C15.1 | 52.35,49.38 v52.3,49.32
  Bottom 0.406: v52.3,49.32 49.35,49.32 v41.05,41.02

### Text on the board
tNames: GND | BAT | GND | VCC | SDA | SCL | BLUE | 5V | Power | USB to UART | VCC | GND | GND | GREEN | VCC | GND | RED | VCC | Open Sensor Platform | Main Board V.2 | Colten Nye, Steve Peirce, Golriz Sedaghat